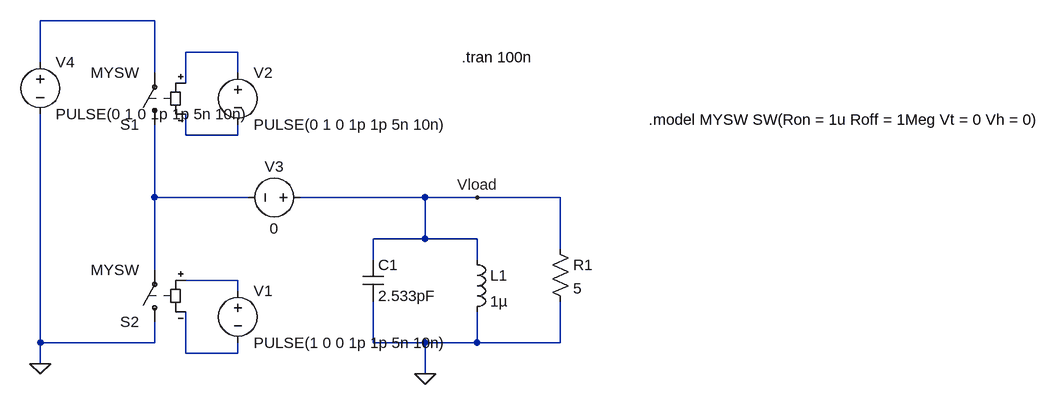
[diagram p0: schematic Draft1.asc]
Draft1.asc, the LTspice schematic file:
Version 4
SHEET 1 1712 680
WIRE 304 48 128 48
WIRE 432 96 352 96
WIRE 128 112 128 48
WIRE 304 128 304 48
WIRE 432 128 432 96
WIRE 352 144 352 96
WIRE 352 224 352 192
WIRE 432 224 432 208
WIRE 432 224 352 224
WIRE 304 320 304 208
WIRE 448 320 304 320
WIRE 720 320 528 320
WIRE 800 320 720 320
WIRE 928 320 800 320
WIRE 720 384 720 320
WIRE 720 384 640 384
WIRE 800 384 720 384
WIRE 928 400 928 320
WIRE 640 416 640 384
WIRE 800 416 800 384
WIRE 304 432 304 320
WIRE 432 448 352 448
WIRE 432 464 432 448
WIRE 128 544 128 192
WIRE 304 544 304 512
WIRE 304 544 128 544
WIRE 640 544 640 480
WIRE 720 544 640 544
WIRE 800 544 800 496
WIRE 800 544 720 544
WIRE 928 544 928 480
WIRE 928 544 800 544
WIRE 352 560 352 496
WIRE 432 560 432 544
WIRE 432 560 352 560
WIRE 128 576 128 544
WIRE 720 592 720 544
FLAG 720 592 0
FLAG 800 320 Vload
FLAG 128 576 0
SYMBOL sw 304 224 R180
SYMATTR InstName S1
SYMATTR Value MYSW
SYMBOL sw 304 528 R180
SYMATTR InstName S2
SYMATTR Value MYSW
SYMBOL ind 784 400 R0
SYMATTR InstName L1
SYMATTR Value 1µ
SYMBOL cap 624 416 R0
SYMATTR InstName C1
SYMATTR Value 2.533pF
SYMBOL voltage 432 448 R0
WINDOW 123 0 0 Left 0
WINDOW 39 0 0 Left 0
SYMATTR InstName V1
SYMATTR Value PULSE(1 0 0 1p 1p 5n 10n)
SYMBOL voltage 432 112 R0
WINDOW 123 0 0 Left 0
WINDOW 39 0 0 Left 0
SYMATTR InstName V2
SYMATTR Value PULSE(0 1 0 1p 1p 5n 10n)
SYMBOL res 912 384 R0
SYMATTR InstName R1
SYMATTR Value 5
SYMBOL voltage 544 320 R90
WINDOW 0 -32 56 VBottom 2
WINDOW 3 32 56 VTop 2
WINDOW 123 0 0 Left 0
WINDOW 39 0 0 Left 0
SYMATTR InstName V3
SYMATTR Value 0
SYMBOL voltage 128 96 R0
WINDOW 123 0 0 Left 0
WINDOW 39 0 0 Left 0
SYMATTR InstName V4
SYMATTR Value PULSE(0 1 0 1p 1p 5n 10n)
TEXT 776 104 Left 2 !.tran 100n
TEXT 1064 200 Left 2 !.model MYSW SW(Ron = 1u Roff = 1Meg Vt = 0 Vh = 0)

The netlist it stands for:
* Draft1.asc
S1 N004 N001 N002 N003 MYSW
S2 0 N004 N005 N006 MYSW
L1 Vload 0 1µ
C1 Vload 0 2.533pF
V1 N005 N006 PULSE(1 0 0 1p 1p 5n 10n)
V2 N002 N003 PULSE(0 1 0 1p 1p 5n 10n)
R1 Vload 0 5
V3 Vload N004 0
V4 N001 0 PULSE(0 1 0 1p 1p 5n 10n)
.tran 100n
.model MYSW SW(Ron = 1u Roff = 1Meg Vt = 0 Vh = 0)
.backanno
.end